# Altium schematic sheet Sensors.SchDoc: Sensors
size 279 x 215 mm; Engineer: Jason Skells; SheetNumber: 3; SheetTotal: 4
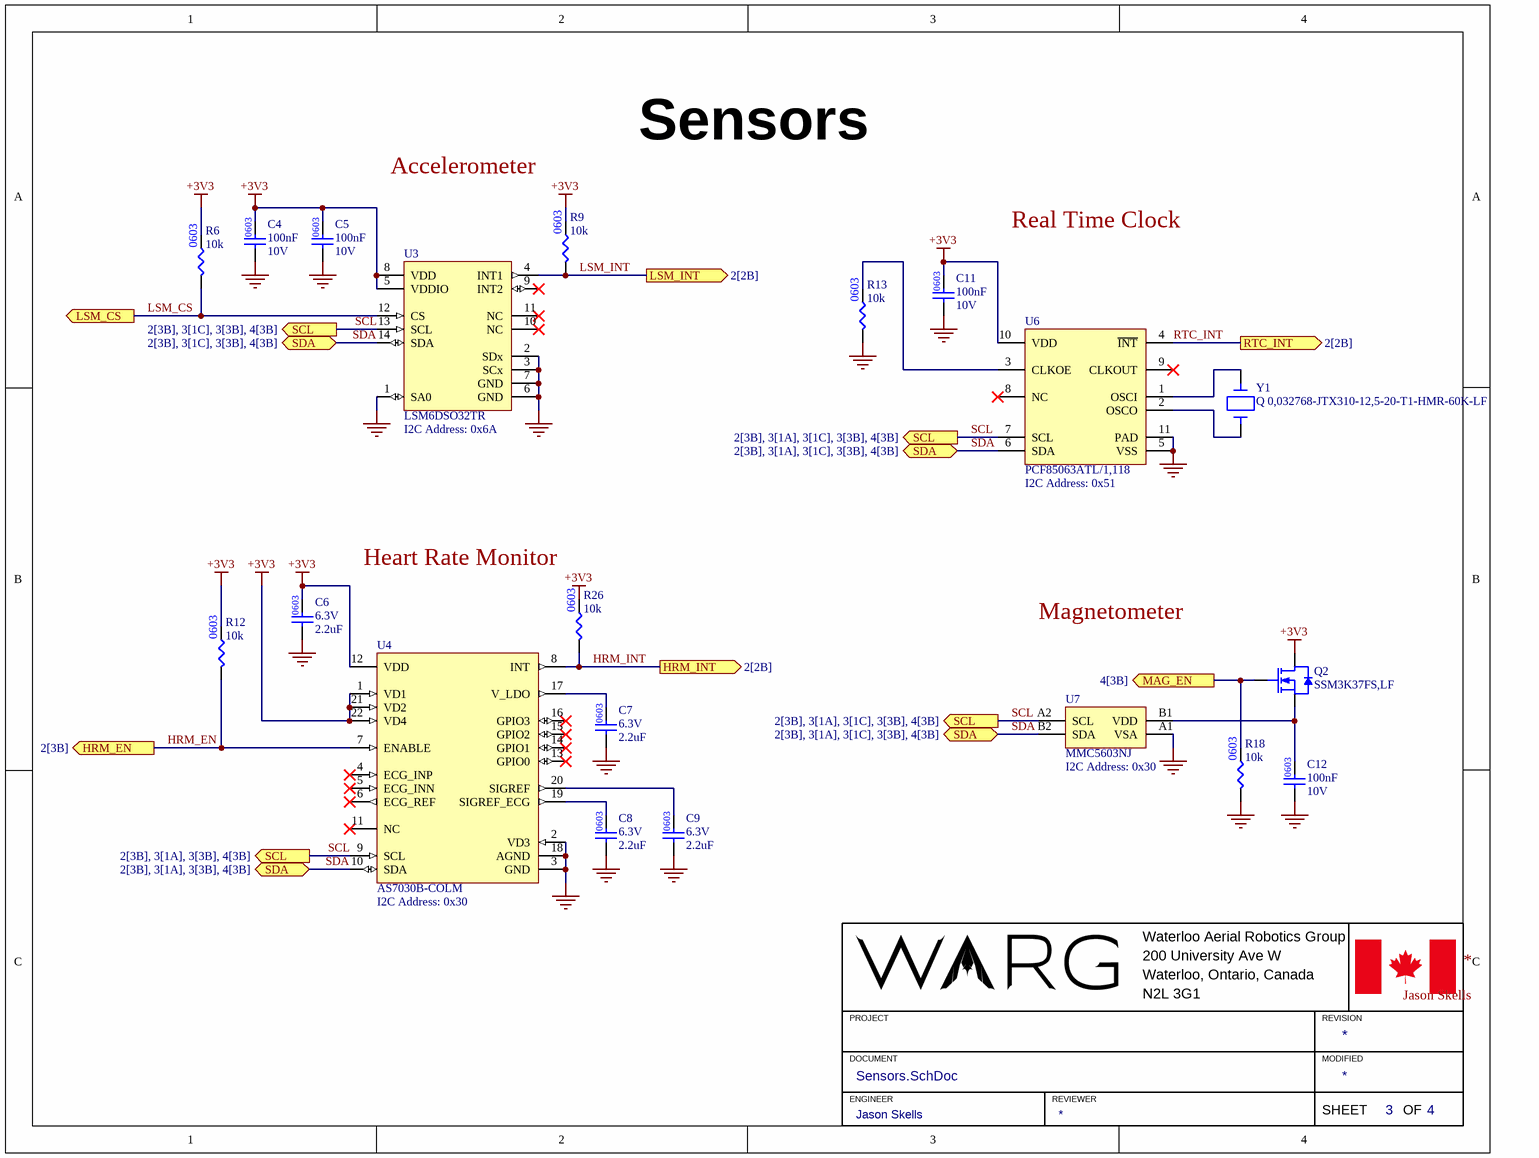
[diagram p0: Sensors.SchDoc]

## Parts
C4  Capacitance: 100nF  Voltage Rating: 10V  [CAP_0603]  (hidden comment: CC0603KRX7R6BB104)
C5  Capacitance: 100nF  Voltage Rating: 10V  [CAP_0603]  (hidden comment: CC0603KRX7R6BB104)
C6  Voltage Rating: 6.3V  Capacitance: 2.2uF  [CAP_0603]  (hidden comment: CL10A225KQ8NNNC)
C7  Voltage Rating: 6.3V  Capacitance: 2.2uF  [CAP_0603]  (hidden comment: CL10A225KQ8NNNC)
C8  Voltage Rating: 6.3V  Capacitance: 2.2uF  [CAP_0603]  (hidden comment: CL10A225KQ8NNNC)
C9  Voltage Rating: 6.3V  Capacitance: 2.2uF  [CAP_0603]  (hidden comment: CL10A225KQ8NNNC)
C11  Capacitance: 100nF  Voltage Rating: 10V  [CAP_0603]  (hidden comment: CC0603KRX7R6BB104)
C12  Capacitance: 100nF  Voltage Rating: 10V  [CAP_0603]  (hidden comment: CC0603KRX7R6BB104)
Q2  SSM3K37FS,LF  [SSM3K37FS,LF]
R6  Resistance: 10k  [RES_0603]  (hidden comment: RNCP0603FTD10K0)
R9  Resistance: 10k  [RES_0603]  (hidden comment: RNCP0603FTD10K0)
R12  Resistance: 10k  [RES_0603]  (hidden comment: RNCP0603FTD10K0)
R13  Resistance: 10k  [RES_0603]  (hidden comment: RNCP0603FTD10K0)
R18  Resistance: 10k  [RES_0603]  (hidden comment: RNCP0603FTD10K0)
R26  Resistance: 10k  [RES_0603]  (hidden comment: RNCP0603FTD10K0)
U3  LSM6DSO32TR  [LSM6DSO32]
U4  AS7030B-COLM  [AS7030B-COLM]
U6  PCF85063ATL/1,118  [PCF85063ATL/1,118]
U7  MMC5603NJ  [MMC5603NJ]
Y1  Q 0,032768-JTX310-12,5-20-T1-HMR-60K-LF  [Q 0,032768-JTX310-12,5-20-T1-HMR-60K-LF]

## Ports
HRM_EN (out, see 2[3B]), HRM_INT (out, see 2[2B]), LSM_CS (out), LSM_INT (out, see 2[2B]), MAG_EN (out, see 4[3B]), RTC_INT (out, see 2[2B]), SCL (out, see 2[3B], 3[1A], 3[1C], 3[3B], 4[3B]), SCL (out, see 2[3B], 3[1A], 3[3B], 4[3B]), SCL (out, see 2[3B], 3[1C], 3[3B], 4[3B]), SDA (bidir, see 2[3B], 3[1A], 3[1C], 3[3B], 4[3B]), SDA (bidir, see 2[3B], 3[1A], 3[3B], 4[3B]), SDA (bidir, see 2[3B], 3[1C], 3[3B], 4[3B])

## Nets
+3V3: C4.2 C5.2 C6.2 C11.2 Q2.1(Drain) R6.2 R9.2 R12.2 R26.2 U3.5(VDDIO) U3.8(VDD) U4.1(VD1) U4.12(VDD) U4.21(VD2) U4.22(VD4) U6.10(VDD)
GND: C4.1 C5.1 C6.1 C7.1 C8.1 C9.1 C11.1 C12.1 R13.1 R18.1 U3.1(SA0) U3.2(SDx) U3.3(SCx) U3.6(GND) U3.7(GND) U4.2(VD3) U4.3(GND) U4.18(AGND) U6.5(VSS) U6.11(PAD) U7.A1(VSA)
HRM_EN: R12.1 U4.7(ENABLE) ; port HRM_EN
HRM_INT: R26.1 U4.8(INT) ; port HRM_INT
LSM_CS: R6.1 U3.12(CS) ; port LSM_CS
LSM_INT: R9.1 U3.4(INT1) ; port LSM_INT
MAG_EN: Q2.2(Gate) R18.2 ; port MAG_EN
RTC_INT: U6.4(~{INT}) ; port RTC_INT
SCL: U3.13(SCL) U4.9(SCL) U6.7(SCL) U7.A2(SCL) ; port SCL
SDA: U3.14(SDA) U4.10(SDA) U6.6(SDA) U7.B2(SDA) ; port SDA
NetC7_2: C7.2 U4.17(V_LDO)
NetC8_2: C8.2 U4.19(SIGREF_ECG)
NetC9_2: C9.2 U4.20(SIGREF)
NetC12_2: C12.2 Q2.3(Source) U7.B1(VDD)
NetR13_2: R13.2 U6.3(CLKOE)
NetU6_1: U6.1(OSCI) Y1.1(In/Out)
NetU6_2: U6.2(OSCO) Y1.2(Out/In)

Not connected (* = marked no-connect by the designer): U3 9(INT2)* 10(NC)* 11(NC)*; U4 4(ECG_INP)* 5(ECG_INN)* 6(ECG_REF)* 11(NC)* 13(GPIO0)* 14(GPIO1)* 15(GPIO2)* 16(GPIO3)*; U6 8(NC)* 9(CLKOUT)*

## Notes on the sheet
- Accelerometer
- Real Time Clock
- (near U3) I2C Address: 0x6A
- (near U6) I2C Address: 0x51
- (near R26) Heart Rate Monitor
- Magnetometer
- (near U7) I2C Address: 0x30
- (near U4) I2C Address: 0x30
- Waterloo Aerial Robotics Group
- 200 University Ave W
- PROJECT
- Waterloo, Ontario, Canada
- N2L 3G1
- REVISION
- DOCUMENT
- ENGINEER
- REVIEWER
- MODIFIED
- SHEET
- OF

## Library data of the parts
C4 C5 C11 C12 = CC0603KRX7R6BB104: CAP CER 0.1UF 10V X7R 0603; Manufacturer: Yageo; Tolerance: 10%; Supplier 1: Digi-Key; Manufacturer Part Number: CC0603KRX7R6BB104; RoHS: Yes; Category: Ceramic Capacitors; Stock 1: 135167; Pricing 1: 1=0.11000, 10=0.07700, 50=0.04340, 100=0.03600, 500=0.02522, 1000=0.02089 (USD); Mount: Surface Mount; Case/Package: 0603; Case Code (Imperial): 0603; Case Code (Metric): 1608; Weight: 7.1E-05oz; Min Operating Temperature: -55°C; Max Operating Temperature: 125°C; Dielectric: X7R; Voltage Rating (DC): 10V; Packaging: Tape and Reel; Termination: SMD/SMT; Resistor Type: Ceramic; Series: CC; Construction: Flat; Length: 1.6mm; Width: 0.8mm; Height: 0.8mm; Thickness: 0.035inch; Depth: 0.8mm; Radiation Hardening: No; Lead Free: Lead Free; Halogen Free: Halogen Free; RoHS Compliant: Yes; ComponentLink1URL: https://datasheet.ciiva.com/11586/upy-gphc-x7r-6-3v-to-50v-8-11586327.pdf?src-supplier=Avnet; ComponentLink1Description: https://datasheet.ciiva.com/11586/upy-gphc-x7r-6-3v-to-50v-8-11586327.pdf?src-supplier=Avnet; Supplier Part Number 1: 311-4055-1-ND
C6-C9 = CL10A225KQ8NNNC: CAP CER 2.2UF 6.3V X5R 0603; Manufacturer: Samsung; Tolerance: 10%; Supplier 1: Digi-Key; Manufacturer Part Number: CL10A225KQ8NNNC; RoHS: Yes; Category: Ceramic Capacitors; Stock 1: 697049; Pricing 1: 1=0.10000, 10=0.04200, 50=0.02300, 100=0.01870, 500=0.01336, 1000=0.01050 (USD); Mount: Surface Mount; Case/Package: 0603; Case Code (Metric): 1608; Case Code (Imperial): 0603; Contact Plating: Tin; Min Operating Temperature: -55°C; Max Operating Temperature: 85°C; Packaging: Tape and Reel; Package Quantity: 1; Dielectric: X5R; Voltage Rating (DC): 6.3V; Series: CL; Construction: Flat; Voltage: 6.3V; Length: 1.6mm; Width: 0.031inch; Height: 0.8mm; Thickness: 0.035inch; Depth: 0.8mm; Radiation Hardening: No; Lead Free: Lead Free; RoHS Compliant: Yes; ComponentLink1URL: https://datasheet.ciiva.com/16199/cl10a225kq8nnnc-16199203.pdf?src-supplier=Future+Electronics; ComponentLink1Description: https://datasheet.ciiva.com/16199/cl10a225kq8nnnc-16199203.pdf?src-supplier=Future+Electronics; ComponentLink2URL: https://datasheet.ciiva.com/15195/getdatasheetpartid-358618-15195712.pdf?src-supplier=Verical; ComponentLink2Description: https://datasheet.ciiva.com/15195/getdatasheetpartid-358618-15195712.pdf?src-supplier=Verical; Supplier Part Number 1: 1276-1183-1-ND
Q2 = SSM3K37FS,LF: MOSFET NCH 20V 200MA SSM; Manufacturer: Toshiba; Rds On Max: 2.2R; Input Capacitance: 12pF; Max Power Dissipation: 100mW; Supplier 1: Digi-Key; RoHS: Yes; Category: MOSFETs; Stock 1: 73760; Pricing 1: 1=0.25000, 10=0.20100, 100=0.10660, 500=0.07012, 1000=0.04768 (USD); Mount: Surface Mount; Packaging: Tape and Reel; Drain to Source Voltage (Vdss): 20V; Continuous Drain Current (ID): 200mA; ComponentLink1URL: https://toshiba.semicon-storage.com/info/docget.jsp?did=6172&prodName=SSM3K37FS&src-supplier=Digi-Key; ComponentLink1Description: https://toshiba.semicon-storage.com/info/docget.jsp?did=6172&prodName=SSM3K37FS&src-supplier=Digi-Key; Supplier Part Number 1: SSM3K37FSLFCT-ND; Manufacturer Part Number: SSM3K37FS,LF
R6 R9 R12 R13 R18 R26 = RNCP0603FTD10K0: Res Thin Film 0603 10K Ohm 1% 1/8W ±100ppm/°C Molded SMD SMD Paper T/R; Manufacturer: Stackpole Electronics; Max Power Dissipation: 125mW; Supplier 1: Digi-Key; Manufacturer Part Number: RNCP0603FTD10K0; RoHS: Yes; Category: Chip SMD Resistors; Stock 1: 2737524; Pricing 1: 1=0.10000, 10=0.06100, 100=0.02480, 1000=0.01113, 2500=0.00966 (USD); Mount: Surface Mount; Case/Package: 0603; Case Code (Metric): 1608; Case Code (Imperial): 0603; Contact Plating: Tin,Matte; Min Operating Temperature: -55°C; Max Operating Temperature: 155°C; Packaging: Tape and Reel; Tolerance: 1%; Resistor Type: Thin Film; Number of Terminations: 2; Temperature Coefficient: 100ppm/°C; Features: Moisture Resistant,Anti-Sulfur; Series: RNCP; Length: 0.059inch; Width: 0.031inch; Height: 0.02inch; Radiation Hardening: No; Lead Free: Lead Free; RoHS Compliant: Yes; ComponentLink1URL: https://www.seielect.com/Catalog/SEI-rncp.pdf?src-supplier=Avnet; ComponentLink1Description: https://www.seielect.com/Catalog/SEI-rncp.pdf?src-supplier=Avnet; ComponentLink2URL: https://www.seielect.com/Catalog/SEI-rncp.pdf?src-supplier=Digi-Key; ComponentLink2Description: https://www.seielect.com/Catalog/SEI-rncp.pdf?src-supplier=Digi-Key; ComponentLink3URL: https://www.seielect.com/catalog/SEI-Packaging.pdf?src-supplier=Digi-Key; ComponentLink3Description: https://www.seielect.com/catalog/SEI-Packaging.pdf?src-supplier=Digi-Key; Supplier Part Number 1: RNCP0603FTD10K0CT-ND
U3 = LSM6DSO32TR: Accelerometer and 3D Gyroscope 3D Always-On 1.71V to 3.6V 0.55mA 14-Pin LGA T/R; Manufacturer: STMicroelectronics; Supplier 1: Digi-Key; Manufacturer Part Number: LSM6DSO32TR; RoHS: Yes; Category: Inertial Measurement Units (IMUs); Stock 1: 3146; Pricing 1: 1=5.47000, 10=4.91400, 25=4.64520, 100=4.02600, 500=3.44102 (USD); Supplier Part Number 1: 497-LSM6DSO32CT-ND
U4 = AS7030B-COLM: AS703x Series 5.5 V Medical or Consumer Grade Vital Sign Sensor Module - OLGA-22; Manufacturer: ams; Supplier 1: Mouser; Manufacturer Part Number: AS7030B-COLM; RoHS: No; Supplier Part Number 1: 985-AS7030B-COLM
U6 = PCF85063ATL/1,118: IC RTC CLK/CALENDAR I2C 10-SON; Manufacturer: NXP Semiconductors; Max Supply Voltage: 5.5V; Min Supply Voltage: 900mV; Logic Function: Clock; Date Format: Binary; Time Format: HH:MM:SS; Supplier 1: Digi-Key; Manufacturer Part Number: PCF85063ATL/1,118; RoHS: Yes; Category: Real Time Clocks; Stock 1: 59710; Pricing 1: 1=0.99000, 10=0.88300, 25=0.83840, 100=0.81280 (USD); Mount: Surface Mount; Case/Package: DFN EP; Number of Pins: 10; Min Operating Temperature: -40°C; Max Operating Temperature: 85°C; Packaging: Tape and Reel; Package Quantity: 4000; Interface: I2C; Radiation Hardening: No; REACH SVHC: No SVHC; Lead Free: Lead Free; RoHS Compliant: Yes; ComponentLink1URL: https://datasheet.ciiva.com/24009/pcf85063atl-260519-24009961.pdf?src-supplier=Mouser; ComponentLink1Description: https://datasheet.ciiva.com/24009/pcf85063atl-260519-24009961.pdf?src-supplier=Mouser; ComponentLink2URL: https://datasheet.ciiva.com/29888/pcf85063a-29888091.pdf?src-supplier=Avnet; ComponentLink2Description: https://datasheet.ciiva.com/29888/pcf85063a-29888091.pdf?src-supplier=Avnet; Supplier Part Number 1: 568-10235-1-ND
U7 = MMC5603NJ: 3-AXIS Amr Magnetic Sensor; Manufacturer: Memsic; Supplier 1: Digi-Key; RoHS: Yes; Stock 1: 55171; Pricing 1: 1=1.12000, 5=1.06600, 10=0.92800, 25=0.81520, 50=0.67720, 100=0.57680, 500=0.50160, 1000=0.43890, 5000=0.38874 (USD); Supplier Part Number 1: 1267-MMC5603NJCT-ND; Manufacturer Part Number: MMC5603NJ
Y1 = Q 0,032768-JTX310-12,5-20-T1-HMR-60K-LF: Crystal 32.7680KHZ 12.5PF SMD; Manufacturer: Jauch; ESR: 60k; Supplier 1: Digi-Key; RoHS: No; Stock 1: 4280; Pricing 1: 1=0.59000, 10=0.49500, 50=0.44560, 100=0.39600, 500=0.37620, 1000=0.31680 (USD); Supplier Part Number 1: 1908-1315-1-ND; Load Capacitance: 12.5pF; Manufacturer Part Number: Q 0,032768-JTX310-12,5-20-T1-HMR-60K-LF